# Altium schematic sheet IR.SchDoc
size A
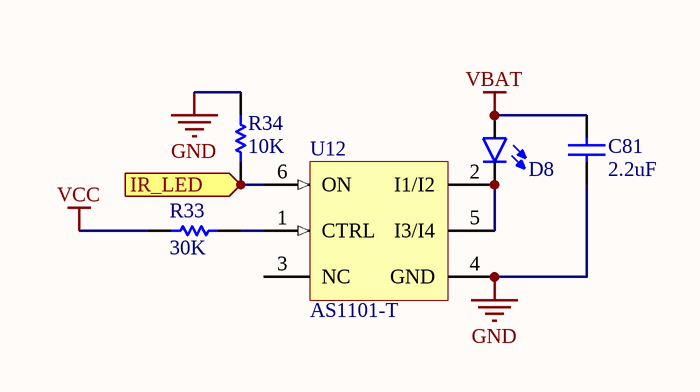
[diagram p0: IR.SchDoc]

## Parts
C81  value 2.2uF  [C0402[1005X55]]  (hidden comment: 2.2uF 6.3V 0402)
D8  SFH 4046  [LED1206]  (value not drawn)
R33  value 30K  [R0402[1005]]  (hidden comment: 30K 1% 0402)
R34  value 10K  [R0402[1005]]  (hidden comment: 10K 1% 0402)
U12  AS1101-T  [AMS-SC70-6-2000X1250DE_N]

## Ports
IR_LED (in)

## Nets
GND: C81.1 R34.2 U12.4(GND)
VBAT: C81.2 D8.A
VCC: R33.1
IR_LED: R34.1 U12.6(ON) ; port IR_LED
NetD8_C: D8.C U12.2(I1/I2) U12.5(I3/I4)
NetR33_2: R33.2 U12.1(CTRL)

Not connected (* = marked no-connect by the designer): U12 3(NC)

## Library data of the parts
C81 = CAP_2.2uF_6.3V_0402_20%: 2.2uF 6.3V 20% 0402 (1005 Metric); PartNumber: GRM155R60J225ME15D; Manufacturer: Murata; Mounting Technology: Surface Mount; PackageReference: 0402; PackageDescription: 0402 (1005 Metric); Voltage: 6.3V; Tolerance: 20%
D8 = SFH 4046: Manufacturer: Osram; PartNumber: SFH 4046; PackageReference: 1206; PackageDescription: 1206 (3216 Metric); Mounting Technology: Surface Mount
R33 = RES_30K_0402_1%: 30K 0.063W 1% 0402 (1005 Metric); Manufacturer: KOA Speer; PartNumber: RK73H1ETTP3002F; Tolerance: 1%; Power: 0.063W; Mounting Technology: Surface Mount; PackageReference: 0402; PackageDescription: 0402 (1005 Metric); ComponentLink1Description: Datasheet; ComponentLink1URL: http://www.koaspeer.com/catimages/Products/RK73H/RK73H.pdf
R34 = RES_10K_0402_1%: 10K 0.063W 1% 0402 (1005 Metric); Manufacturer: KOA Speer; PartNumber: RK73H1ETTP1002F; Tolerance: 1%; Power: 0.063W; Mounting Technology: Surface Mount; PackageReference: 0402; PackageDescription: 0402 (1005 Metric); ComponentLink1Description: Datasheet; ComponentLink1URL: http://www.koaspeer.com/catimages/Products/RK73H/RK73H.pdf
U12 = CMP-0558-00027-2: 80 mA, Simple Drive, Dual LED Driver with Enable, 2.2 to 3.6 V, SC70-6, Reel; Manufacturer: AMS; LED-to-LED Matching (%): 3; LED Current per Output (mA): 80; Outputs: 2; ComponentLink1URL: www.ams.com; Mounting Technology: Surface Mount; PartNumber: AS1101-T; ComponentLink2Description: Datasheet; PackageDescription: 6-Pin SOT23, 2 x 1.25 mm Body, 0.65 mm Pitch; Supply Voltage (V): 2.2 to 3.6; ComponentLink1Description: Manufacturer URL; Code_JEDEC: MO-203; PackageVersion: Rev. 1.5, 09/2007; PackageReference: SC70-6; ComponentLink2URL: http://www.ams.com/eng/content/download/1193/6938/515; Features: Simple Drive; DatasheetVersion: Rev. 1.5